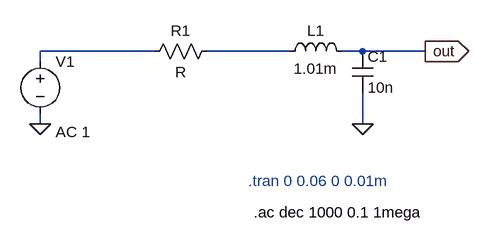
[diagram p0: schematic Filtro_RFI_entrada.asc]
Filtro_RFI_entrada.asc, the LTspice schematic file:
Version 4.1
SHEET 1 880 680
WIRE -112 112 -288 112
WIRE 96 112 -32 112
WIRE 208 112 176 112
WIRE 304 112 208 112
WIRE -288 128 -288 112
WIRE -288 224 -288 208
WIRE 208 224 208 176
FLAG 208 224 0
FLAG -288 224 0
FLAG 304 112 out
IOPIN 304 112 Out
SYMBOL ind 80 128 R270
WINDOW 0 32 56 VTop 2
WINDOW 3 5 56 VBottom 2
SYMATTR InstName L1
SYMATTR Value 1.01m
SYMATTR SpiceLine Rser=449
SYMBOL cap 192 112 R0
SYMATTR InstName C1
SYMATTR Value 10n
SYMBOL voltage -288 112 R0
WINDOW 3 24 152 Left 2
WINDOW 123 24 124 Left 2
WINDOW 39 0 0 Left 0
SYMATTR Value ""
SYMATTR Value2 AC 1
SYMATTR InstName V1
SYMBOL res -16 96 R90
WINDOW 0 0 56 VBottom 2
WINDOW 3 32 56 VTop 2
SYMATTR InstName R1
TEXT 40 360 Left 2 !.ac dec 1000 0.1 1mega
TEXT 32 312 Left 2 ;.tran 0 0.06 0 0.01m

The netlist it stands for:
* Filtro_RFI_entrada.asc
L1 N002 out 1.01m Rser=449
C1 out 0 10n
V1 N001 0 AC 1
R1 N002 N001 R
.ac dec 1000 0.1 1mega
* .tran 0 0.06 0 0.01m
.backanno
.end